# Altium schematic sheet STPMS2&PT100.SchDoc: STPMS2&PT100
size A3; DocumentNumber: MB1144; Revision: C-02; SheetNumber: 21; SheetTotal: 25; Project: STM32L476G-EVAL; ModifiedDate: 9/23/2015
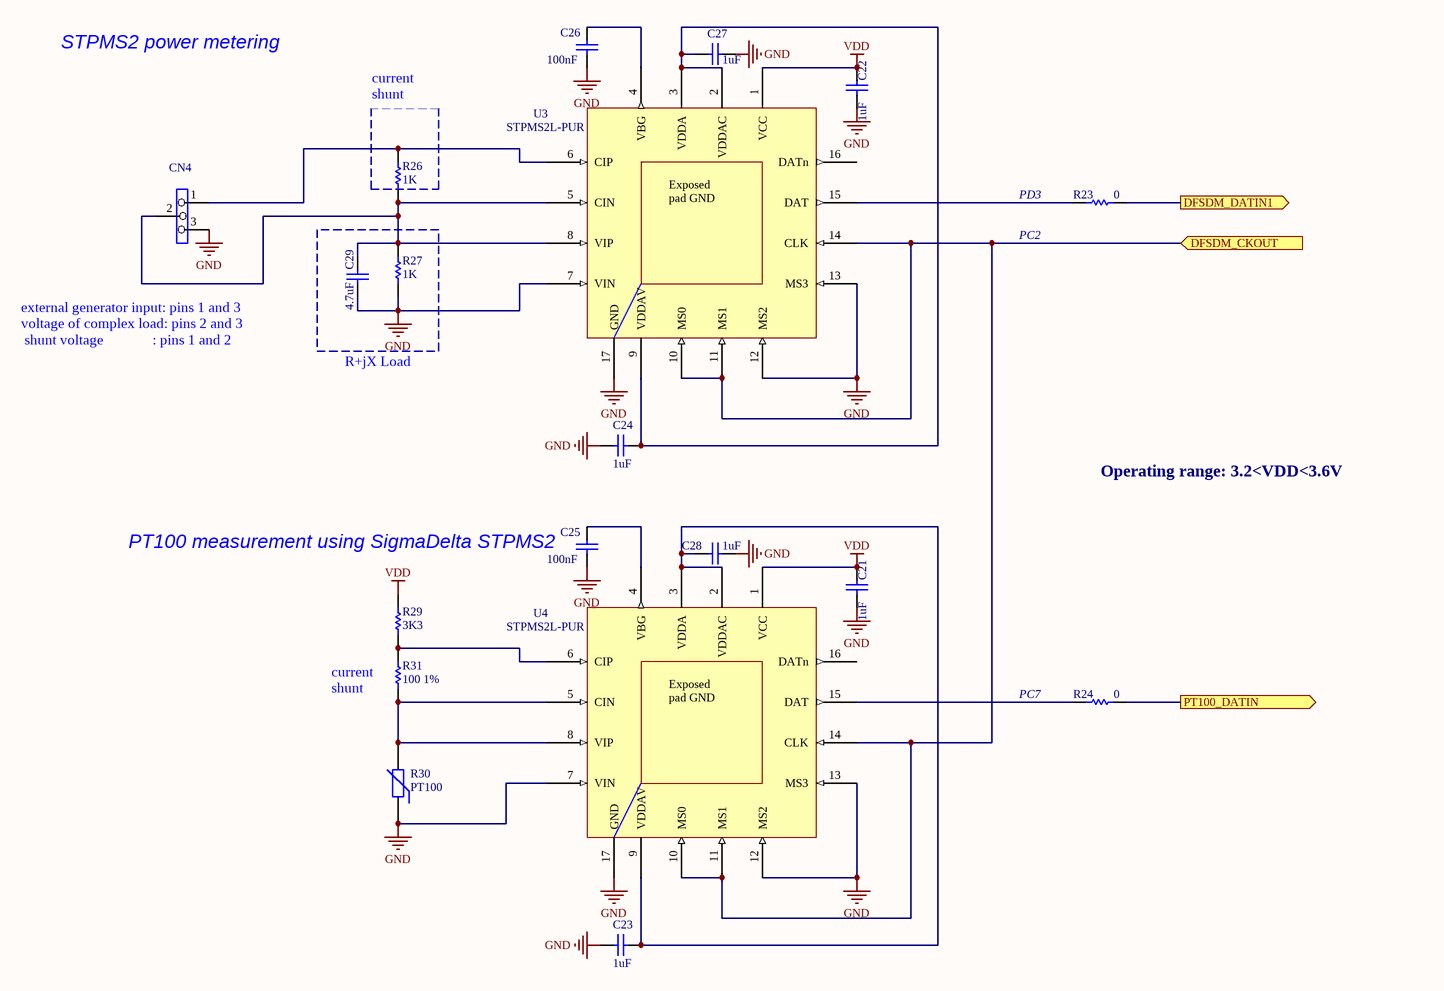
[diagram p0: STPMS2&PT100.SchDoc]

## Parts
C21  1uF  [0603C]
C22  1uF  [0603C]
C23  1uF  [0603C]
C24  1uF  [0603C]
C25  100nF  [0402C]
C26  100nF  [0402C]
C27  1uF  [0603C]
C28  1uF  [0603C]
C29  4.7uF  [0603C]
CN4  Header 3X1  [SIP3]  (value not drawn)
R23  0  [0603R]
R24  0  [0603R]
R26  1K  [0402R]
R27  1K  [0402R]
R29  3K3  [0402R]
R30  PT100  [HDR_1X2_1R27]
R31  100 1%  [0603R]
U3  STPMS2L-PUR  [QFN16_0R65_4X4]
U4  STPMS2L-PUR  [QFN16_0R65_4X4]

## Ports
DFSDM_CKOUT (in), DFSDM_DATIN1 (out), PT100_DATIN (out)

## Nets
GND: C21.2 C22.2 C23.1 C24.1 C25.1 C26.1 C27.2 C28.2 C29.2 CN4.3 R27.2 R30.1 U3.7(VIN) U3.12(MS2) U3.13(MS3) U3.17(GND) U4.7(VIN) U4.12(MS2) U4.13(MS3) U4.17(GND)
VDD: C21.1 C22.1 R29.1 U3.1(VCC) U4.1(VCC)
DFSDM_CKOUT: U3.10(MS0) U3.11(MS1) U3.14(CLK) U4.10(MS0) U4.11(MS1) U4.14(CLK) ; port DFSDM_CKOUT
DFSDM_DATIN1: R23.1 ; port DFSDM_DATIN1
PT100_DATIN: R24.1 ; port PT100_DATIN
NetC23_2: C23.2 C28.1 U4.2(VDDAC) U4.3(VDDA) U4.9(VDDAV)
NetC24_2: C24.2 C27.1 U3.2(VDDAC) U3.3(VDDA) U3.9(VDDAV)
NetC25_2: C25.2 U4.4(VBG)
NetC26_2: C26.2 U3.4(VBG)
NetC29_1: C29.1 CN4.2 R26.2 R27.1 U3.5(CIN) U3.8(VIP)
NetCN4_1: CN4.1 R26.1 U3.6(CIP)
NetR23_2: R23.2 U3.15(DAT)
NetR24_2: R24.2 U4.15(DAT)
NetR29_2: R29.2 R31.1 U4.6(CIP)
NetR30_2: R30.2 R31.2 U4.5(CIN) U4.8(VIP)

Not connected (* = marked no-connect by the designer): U3 16(DATn); U4 16(DATn)

## Notes on the sheet
- STPMS2 power metering
- current shunt
- (near R23) PD3
- PC2
- external generator input: pins 1 and 3
  voltage of complex load: pins 2 and 3
  shunt voltage              : pins 1 and 2
- R+jX Load
- PT100 measurement using SigmaDelta STPMS2
- Operating range: 3.2<VDD<3.6V
- (near R31) current shunt
- (near R24) PC7
- Title:
- Project:
- Size:
- Date:
- A3
- Reference:
- Sheet:
- Revision:
- of
- (in symbol STPMS2) Exposed pad GND

## Library data of the parts
C21-C24 C27-C29 = CAP: Capacitor; Value: 100nF; Ordered by: Subcon; ECCN_US/EU: NA; Published: 8-Jun-2000; Revision: July-2002: Re-released for DXP Platform.; Publisher: Altium Limited
C25 C26 = Cap: Capacitor; Value: 10nF; Ordered by: Subcon; ECCN_US/EU: NA; Published: 8-Jun-2000; Revision: July-2002: Re-released for DXP Platform.; Publisher: Altium Limited
CN4 = Jumper3: Ordered by: Subcon; ECCN_US/EU: NA
R23 R24 = res1: Resistor; Value: 1K; Ordered by: Subcon; ECCN_US/EU: NA; Published: 8-Jun-2000; Revision: July-2002: Re-released for DXP Platform.; Publisher: Altium Limited
R26 R27 = Res1: Resistor; Ordered by: Subcon; ECCN_US/EU: NA; Published: 8-Jun-2000; Revision: July-2002: Re-released for DXP Platform.; Publisher: Altium Limited; Value: 1K
R29 R31 = Res1: Resistor; Value: 1K; Ordered by: Subcon; ECCN_US/EU: NA; Published: 8-Jun-2000; Revision: July-2002: Re-released for DXP Platform.; Publisher: Altium Limited
R30 = PT100: Varistor (Voltage-Sensitive Resistor); ECCN_US/EU: NA; Ordered by: Subcon; Published: 24-Mar-1999; Revision: July-2002: Re-released for DXP Platform.; Publisher: Altium Limited
U3 U4 = STPMS2: STM sigmaDelta modulator; Ordered by: ST; ECCN_US/EU: EAR99/NEC; Ref St: 9177717; Manuf_1: ST; Manuf_Part_1: STPMS2L-PUR